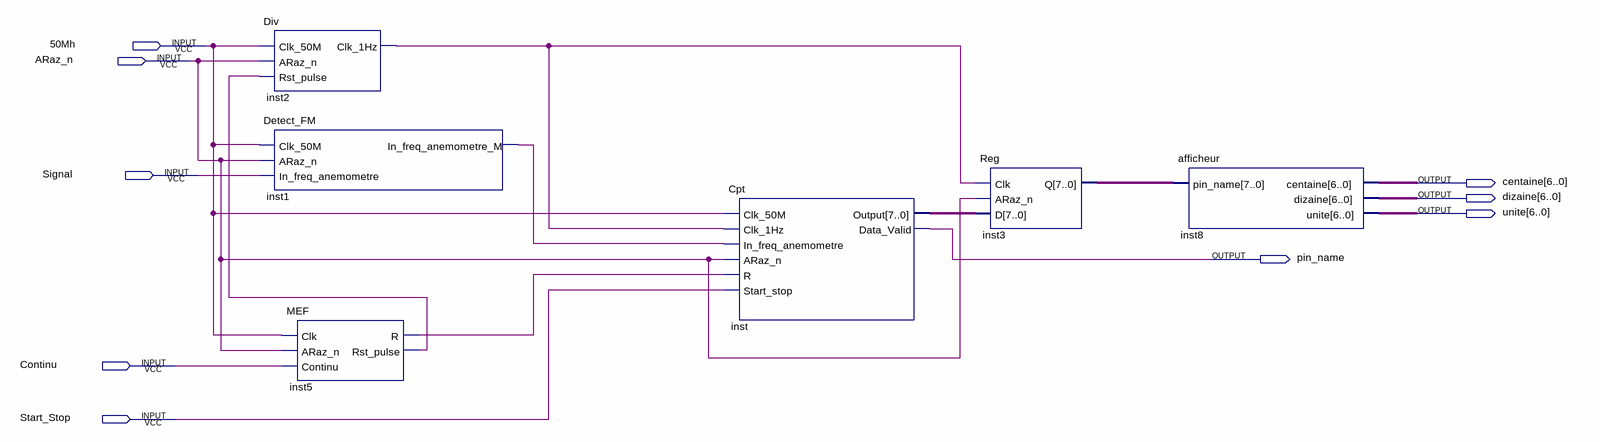
[diagram p0: schematic sheet]
// Quartus schematic Test.bdf as structural Verilog: 6 symbols, 9 pins
module Test (
  input  \50Mh ,
  input  ARaz_n,
  input  Signal,
  input  Continu,
  input  Start_Stop,
  output [6:0] centaine,
  output [6:0] dizaine,
  output [6:0] unite,
  output pin_name
);

  wire inst1_in_freq_anemometre_m, inst2_clk_1hz, inst5_r, inst5_rst_pulse;
  wire [7:0] inst3_q, inst_output;

  Div inst2 (.Clk_50M(\50Mh ), .ARaz_n(ARaz_n), .Rst_pulse(inst5_rst_pulse), .Clk_1Hz(inst2_clk_1hz));
  Detect_FM inst1 (
    .Clk_50M(\50Mh ), .ARaz_n(ARaz_n), .In_freq_anemometre(Signal),
    .In_freq_anemometre_M(inst1_in_freq_anemometre_m));
  MEF inst5 (.Clk(\50Mh ), .ARaz_n(ARaz_n), .Continu(Continu), .R(inst5_r), .Rst_pulse(inst5_rst_pulse));
  Cpt inst (
    .Clk_50M(\50Mh ), .Clk_1Hz(inst2_clk_1hz), .In_freq_anemometre(inst1_in_freq_anemometre_m),
    .ARaz_n(ARaz_n), .R(inst5_r), .Start_stop(Start_Stop), .Output(inst_output), .Data_Valid(pin_name));
  Reg inst3 (.Clk(inst2_clk_1hz), .ARaz_n(ARaz_n), .D(inst_output), .Q(inst3_q));
  afficheur inst8 (.pin_name(inst3_q), .centaine(centaine), .dizaine(dizaine), .unite(unite));
endmodule
